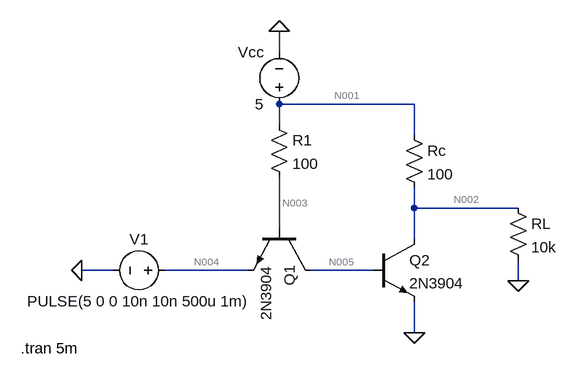
[diagram p0: schematic TTL_NOT.asc]
TTL_NOT.asc, the LTspice schematic file:
Version 4
SHEET 1 880 680
WIRE 144 -80 144 -112
WIRE 352 0 144 0
WIRE 144 32 144 0
WIRE 352 48 352 0
WIRE 352 160 352 128
WIRE 512 160 352 160
WIRE 144 192 144 112
WIRE 352 208 352 160
WIRE -112 256 -160 256
WIRE 96 256 -32 256
WIRE 288 256 192 256
WIRE 512 272 512 240
WIRE 352 352 352 304
FLAG 352 352 0
FLAG -160 256 0
FLAG 144 -112 0
FLAG 512 272 0
SYMBOL voltage 144 16 R180
WINDOW 0 24 96 Left 2
WINDOW 3 24 16 Left 2
SYMATTR InstName Vcc
SYMATTR Value 5
SYMBOL voltage -16 256 R90
WINDOW 0 -32 56 VBottom 2
WINDOW 3 32 56 VTop 2
WINDOW 123 0 0 Left 0
WINDOW 39 0 0 Left 0
SYMATTR InstName V1
SYMATTR Value PULSE(5 0 0 10n 10n 500u 1m)
SYMBOL npn 192 192 R90
SYMATTR InstName Q1
SYMATTR Value 2N3904
SYMBOL res 128 16 R0
SYMATTR InstName R1
SYMATTR Value 100
SYMBOL res 336 32 R0
SYMATTR InstName Rc
SYMATTR Value 100
SYMBOL npn 288 208 R0
SYMATTR InstName Q2
SYMATTR Value 2N3904
SYMBOL res 496 144 R0
SYMATTR InstName RL
SYMATTR Value 10k
TEXT -254 376 Left 2 !.tran 5m

The netlist it stands for:
* TTL_NOT.asc
Vcc N001 0 5
V1 N004 0 PULSE(5 0 0 10n 10n 500u 1m)
Q1 N005 N003 N004 0 2N3904
R1 N001 N003 100
Rc N001 N002 100
Q2 N002 N005 0 0 2N3904
RL N002 0 10k
.model NPN NPN
.model PNP PNP
.lib standard.bjt
.tran 5m
.backanno
.end

* Results of the author's LTspice run, read from the files saved beside the schematic
* Operating Point, zero values left out:
*   V(n001) = 5 V
*   V(n004) = 5 V
*   V(n005) = 2.37 V
*   V(n003) = 3.45 V
*   V(n002) = 31.82 mV
*   Ic(Q2) = 49.68 mA
*   Ib(Q2) = 77.03 mA
*   Ie(Q2) = -126.7 mA
*   Ic(Q1) = -77.03 mA
*   Ib(Q1) = 15.5 mA
*   Ie(Q1) = 61.53 mA
*   I(Rl) = 3.182 µA
*   I(Rc) = 49.68 mA
*   I(R1) = 15.5 mA
*   I(V1) = -61.53 mA
*   I(Vcc) = -65.18 mA
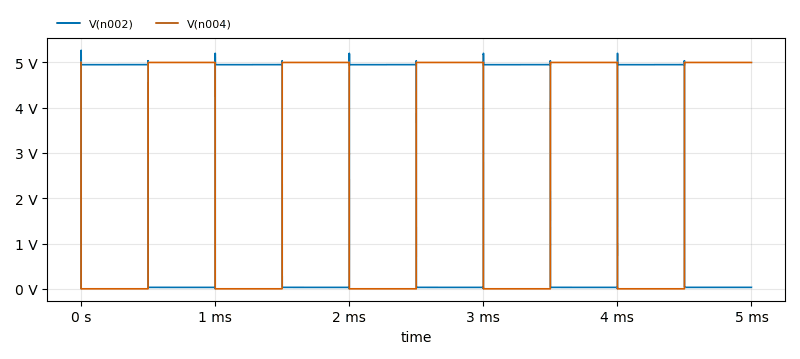
[diagram p1: Transient Analysis of TTL_NOT.asc, plotted from the saved traces]
* Transient Analysis, 1 run:
*   V(n002): min 7.511 mV, max 5.267 V, average 2.486 V, rms 3.497 V, last 31.82 mV
*   V(n004): min 0 V, max 5 V, average 2.5 V, rms 3.535 V, last 5 V